# EAGLE design A100C (EAGLE 6.6.0)
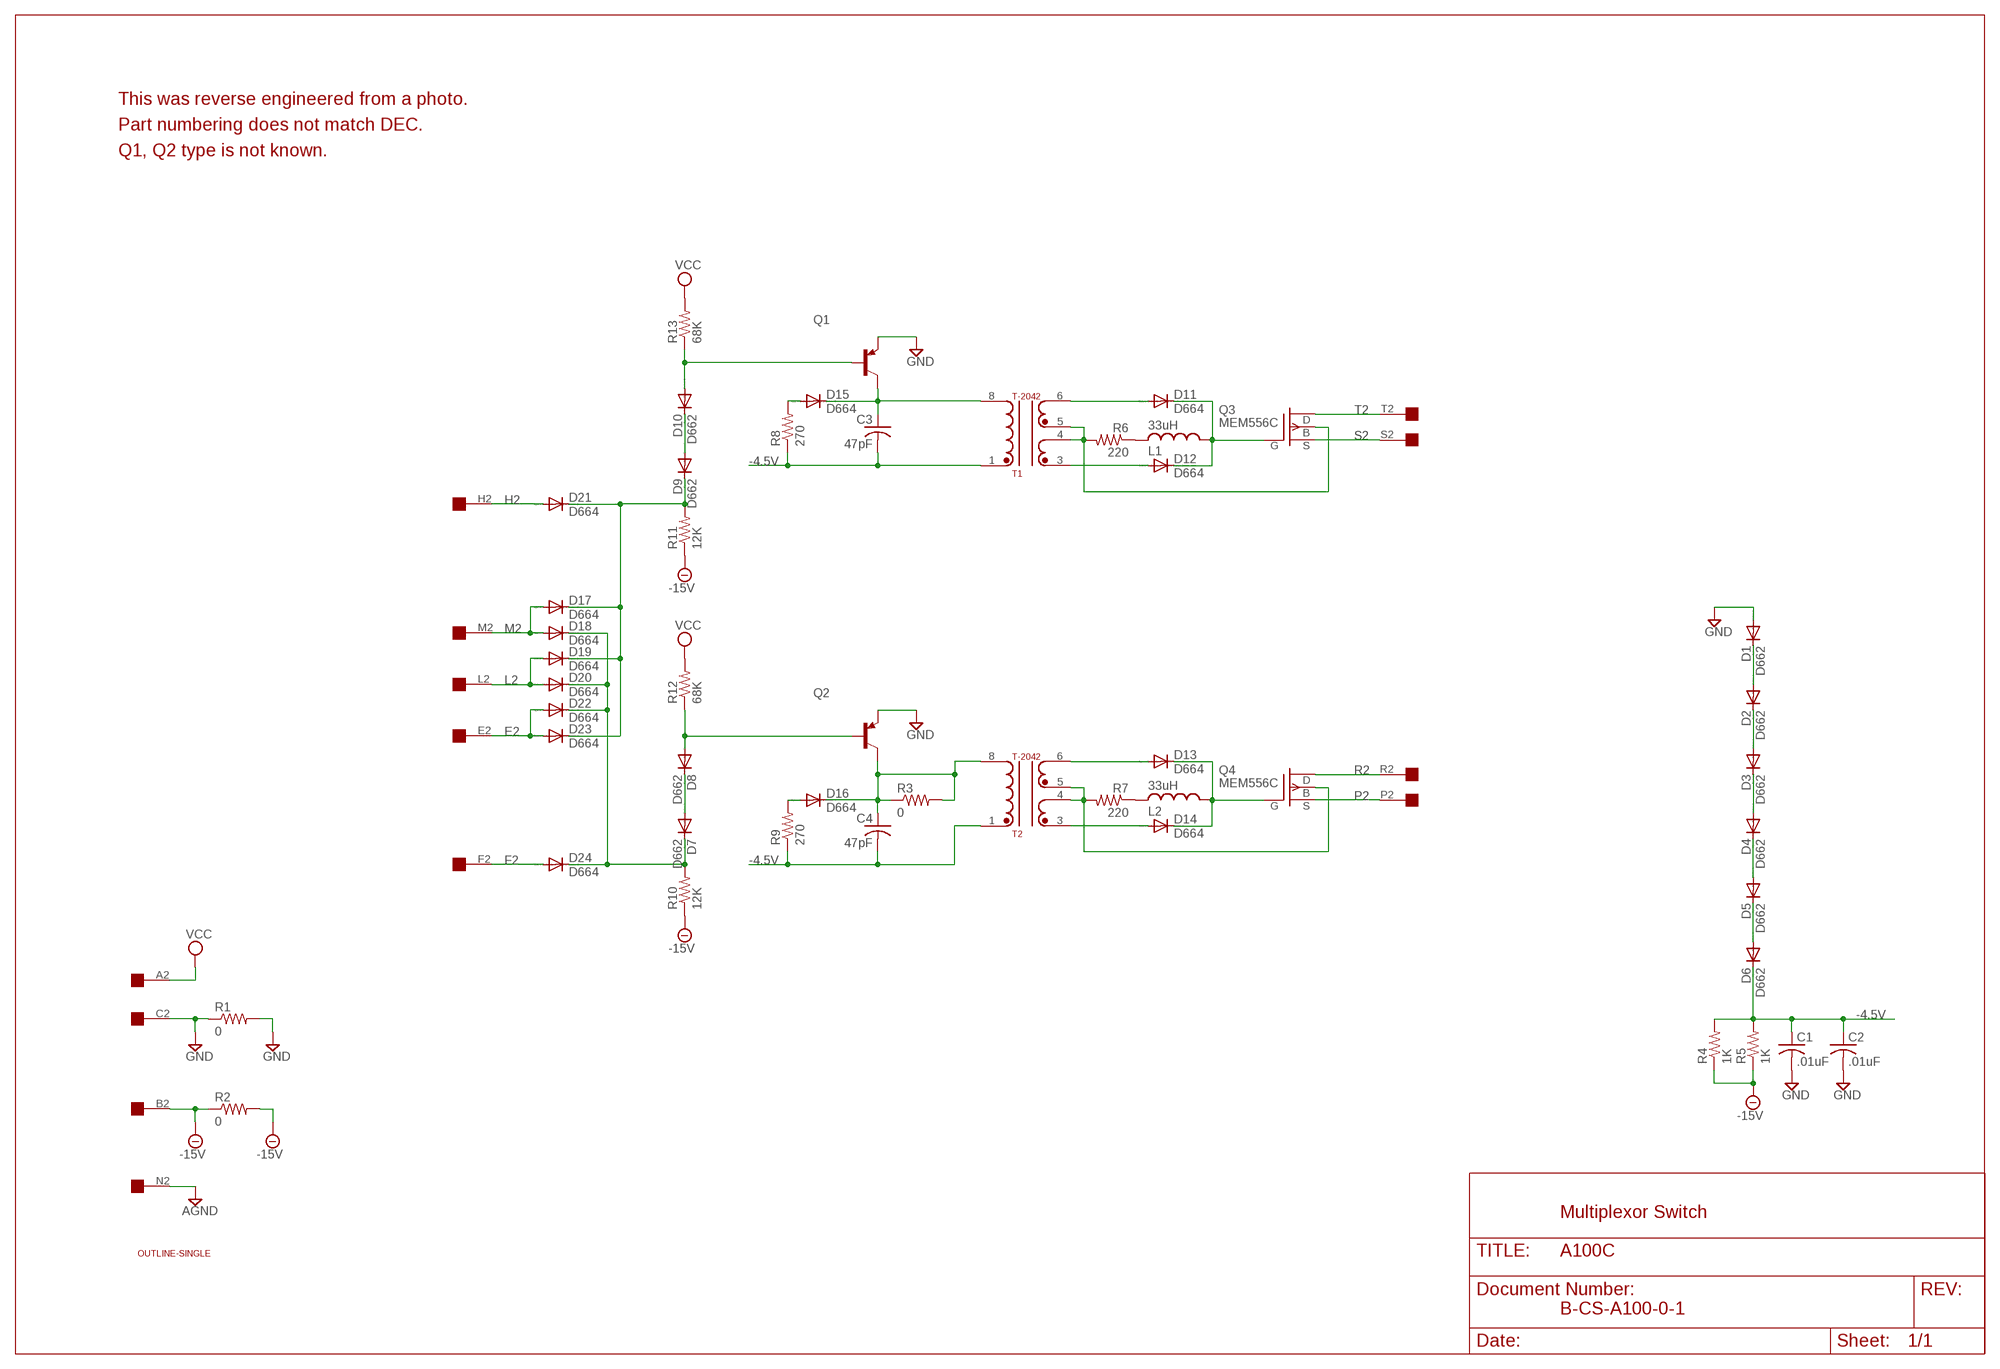
[diagram p0: schematic, sheet 1]

## Parts
C1  .01uF  C-US  [C063-025X075]
C2  .01uF  C-US  [C063-025X075]
C3  47pF  C-US  [C063-025X075]
C4  47pF  C-US  [C063-025X075]
D1  D662  DIODE-DO35-10  [DO35-10]
D2  D662  DIODE-DO35-10  [DO35-10]
D3  D662  DIODE-DO35-10  [DO35-10]
D4  D662  DIODE-DO35-10  [DO35-10]
D5  D662  DIODE-DO35-10  [DO35-10]
D6  D662  DIODE-DO35-10  [DO35-10]
D7  D662  DIODE-DO35-10  [DO35-10]
D8  D662  DIODE-DO35-10  [DO35-10]
D9  D662  DIODE-DO35-10  [DO35-10]
D10  D662  DIODE-DO35-10  [DO35-10]
D11  D664  DIODE-DO35-10  [DO35-10]
D12  D664  DIODE-DO35-10  [DO35-10]
D13  D664  DIODE-DO35-10  [DO35-10]
D14  D664  DIODE-DO35-10  [DO35-10]
D15  D664  DIODE-DO35-10  [DO35-10]
D16  D664  DIODE-DO35-10  [DO35-10]
D17  D664  DIODE-DO35-10  [DO35-10]
D18  D664  DIODE-DO35-10  [DO35-10]
D19  D664  DIODE-DO35-10  [DO35-10]
D20  D664  DIODE-DO35-10  [DO35-10]
D21  D664  DIODE-DO35-10  [DO35-10]
D22  D664  DIODE-DO35-10  [DO35-10]
D23  D664  DIODE-DO35-10  [DO35-10]
D24  D664  DIODE-DO35-10  [DO35-10]
L1  33uH  L-US0207/15  [0207/15]
L2  33uH  L-US0207/15  [0207/15]
Q1  -PNP-TO5  [TO5]
Q2  -PNP-TO5  [TO5]
Q3  MEM556C  [TO72]
Q4  MEM556C  [TO72]
R1  0  R-US_0207/10  [0207/10]
R2  0  R-US_0207/10  [0207/10]
R3  0  R-US_0207/10  [0207/10]
R4  1K  R-US_0207/10  [0207/10]
R5  1K  R-US_0207/10  [0207/10]
R6  220  R-US_0207/10  [0207/10]
R7  220  R-US_0207/10  [0207/10]
R8  270  R-US_0207/10  [0207/10]
R9  270  R-US_0207/10  [0207/10]
R10  12K  R-US_0207/10  [0207/10]
R11  12K  R-US_0207/10  [0207/10]
R12  68K  R-US_0207/10  [0207/10]
R13  68K  R-US_0207/10  [0207/10]
T1  T-2042  [TRANSFORMER6C]
T2  T-2042  [TRANSFORMER6C]
U$1  OUTLINE-SINGLE  [SINGLE]
U$2  EDGE-1  [EDGE-CON1]

## Nets
-4.5V: C1.1 C2.1 C3.2 C4.2 D6.C R4.2 R5.2 R8.1 R9.1 T1.1 T2.1
-15V: R2.1 R2.2 R4.1 R5.1 R10.1 R11.1 U$2.B2
AGND: U$2.N2
E2: D22.A D23.A U$2.E2
F2: D24.A U$2.F2
GND: C1.2 C2.2 D1.A Q1.1(E) Q2.1(E) R1.1 R1.2 U$2.C2
H2: D21.A U$2.H2
L2: D19.A D20.A U$2.L2
M2: D17.A D18.A U$2.M2
N$1: D1.C D2.A
N$2: D2.C D3.A
N$3: D3.C D4.A
N$4: D4.C D5.A
N$5: D5.C D6.A
N$6: C4.1 D16.C Q2.3(C) R3.1 R3.2 T2.8
N$7: D9.C D17.C D19.C D21.C D23.C R11.2
N$8: D7.C D18.C D20.C D22.C D24.C R10.2
N$9: D7.A D8.C
N$10: D9.A D10.C
N$11: D8.A Q2.2(B) R12.1
N$12: D10.A Q1.2(B) R13.1
N$13: C3.1 D15.C Q1.3(C) T1.8
N$14: D15.A R8.2
N$15: D16.A R9.2
N$16: Q3.4(B) R6.2 T1.4 T1.5
N$17: L1.2 R6.1
N$18: L2.2 R7.1
N$19: D11.C D12.C L1.1 Q3.1(G)
N$20: D13.C D14.C L2.1 Q4.1(G)
N$21: Q4.4(B) R7.2 T2.4 T2.5
N$22: D12.A T1.3
N$23: D11.A T1.6
N$24: D14.A T2.3
N$25: D13.A T2.6
P2: Q4.3(S) U$2.P2
R2: Q4.2(D) U$2.R2
S2: Q3.3(S) U$2.S2
T2: Q3.2(D) U$2.T2
VCC: R12.2 R13.2 U$2.A2
Unconnected: U$2.D2 U$2.J2 U$2.K2 U$2.U2 U$2.V2

## Notes on the sheet
- This was reverse engineered from a photo.
- Part numbering does not match DEC.
- Q1, Q2 type is not known.
- Multiplexor Switch
- B-CS-A100-0-1

## Library data of the parts
C1-C4 = dec-con:C-US: Capacitors with funky DEC lead spacing.
D1-D24 = diode:DIODE-: DIODE
L1 L2 = rcl:L-US: INDUCTOR, American symbol
Q1 Q2 = transistor:*-PNP-: PNP Transistror
Q3 Q4 = dec-con:MEM556C: Analog Switching FET
R1-R13 = rcl:R-US_: RESISTOR, American symbol
T1 T2 = dec-con:T-2042: T-2042 Transformer
U$1 = dec-con:OUTLINE-*: Board outlines for DEC boards.
U$2 = dec-con:EDGE-1: Single-Sided DEC Edge Connector -- (side 2)

## Net classes
0 default: width 0.813 mm

## Board
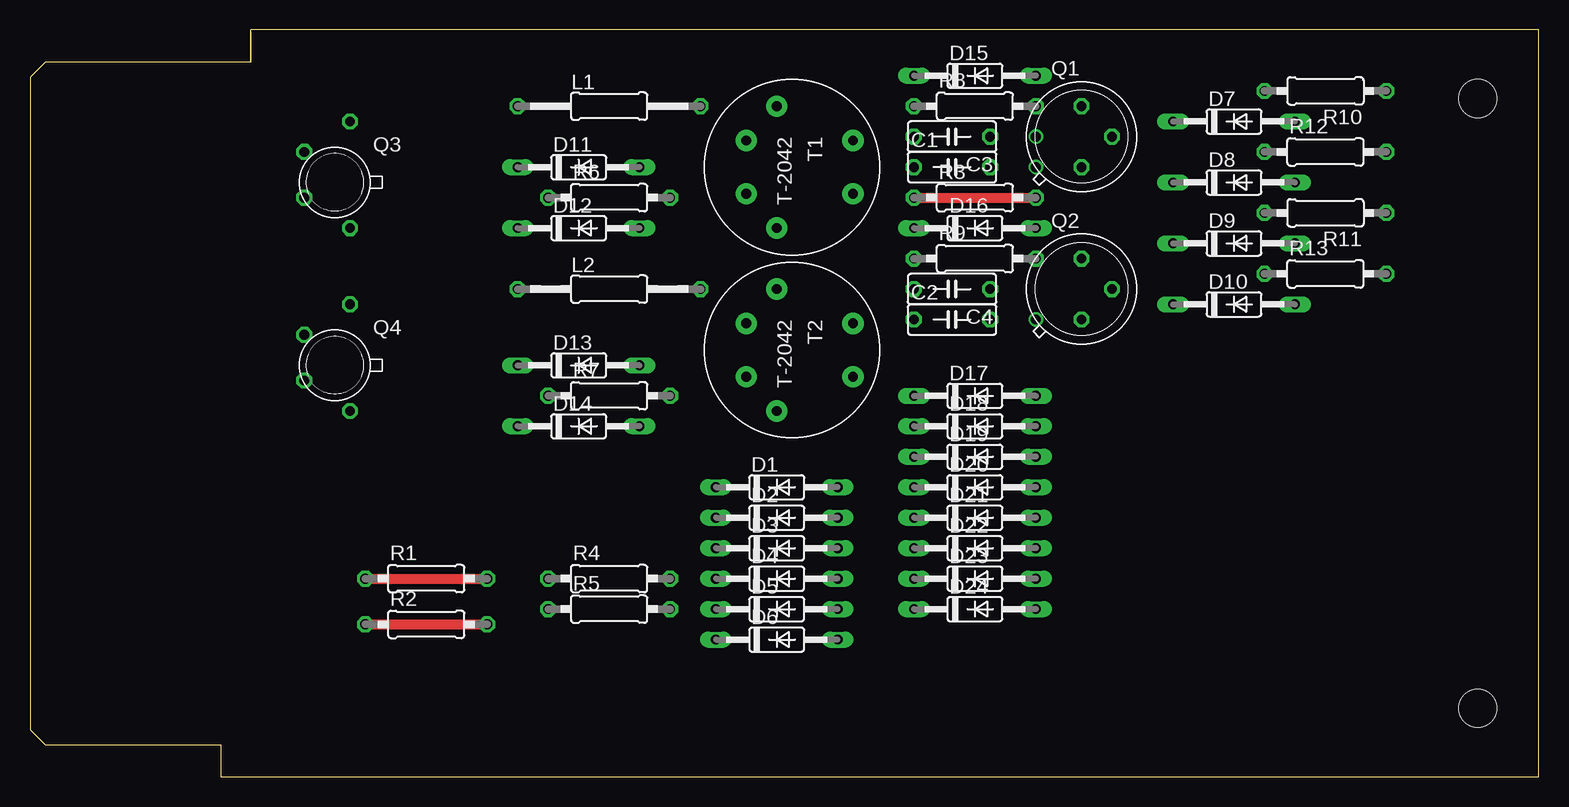
[diagram p1: board, top side]
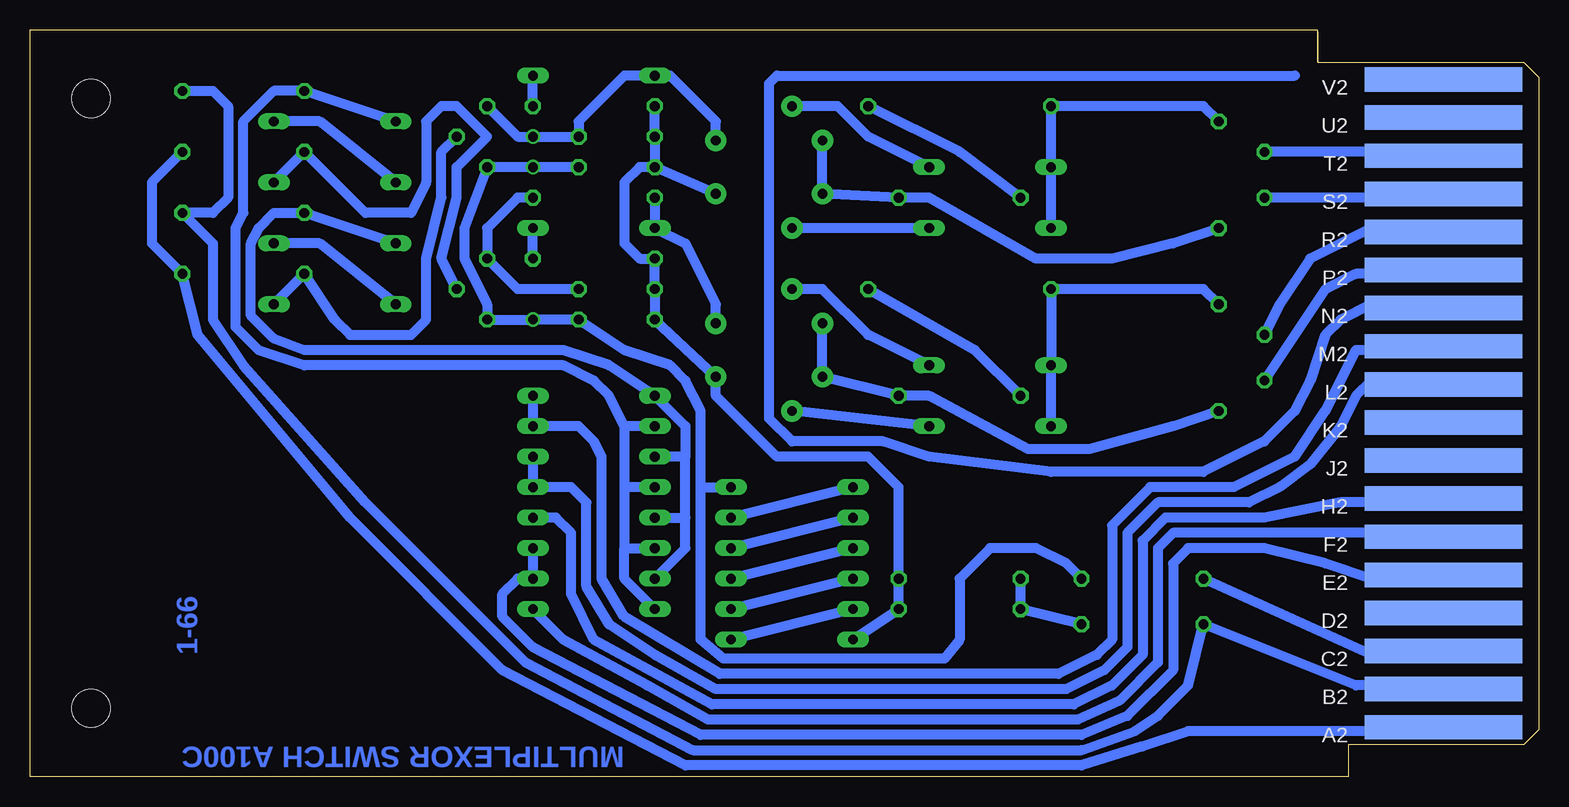
[diagram p2: board, bottom side, seen from below]

Size 125.73 x 62.23 mm. Coordinates in mm from the lower left corner, seen from the top.
Copper layers (1+16): Top 0.035mm / dielectric 1.5mm / Bottom 0.035mm
Design rules "16mils": minimum track width 16mil, minimum drill 32mil, track to track 15mil, track to pad 10mil, pad to pad 10mil, via to via 10mil, smd to smd 10mil, copper to edge 13mil, drill to drill 10mil, minimum pad ring 10mil, minimum via ring 8mil, stop-mask expansion 0mil, vias tented up to drill 0mil, thermal gap 10mil

### Footprints (pad centres in the part's own frame; a part is rotated, then mirrored left to right if it is on the bottom)
C063-025X075 = drill 0.813 octagon: 1 -2.54,0; 2 3.81,0
DO35-10 = drill 0.813 long: A 5.08,0; C -5.08,0
0207/15 = drill 0.813 octagon: 1 -7.62,0; 2 7.62,0
TO5 = drill 0.813 octagon: 1 0,-2.54; 2 2.54,0; 3 0,2.54
TO72 = drill 0.813 octagon: 1 -1.27,-5.08; 2 2.54,-2.54; 3 2.54,1.27; 4 -1.27,3.81
0207/10 = drill 0.813 octagon: 1 -5.08,0; 2 5.08,0
TRANSFORMER6C = drill 0.813 pad 1.778: 1 2.223,5.08; 3 5.08,-1.27; 4 2.223,-3.81; 5 -2.223,-3.81; 6 -5.08,-1.27; 8 -2.223,5.08
SINGLE = hole 3.175: 120.65,56.515; 120.65,5.715
EDGE-CON1 = smd 13.106 x 2.032 bottom: A2 7.938,4.128; B2 7.938,7.303; C2 7.938,10.477; D2 7.938,13.652; E2 7.938,16.828; F2 7.938,20.003; H2 7.938,23.177; J2 7.938,26.352; K2 7.938,29.527; L2 7.938,32.703; M2 7.938,35.877; N2 7.938,39.053; P2 7.938,42.227; R2 7.938,45.403; S2 7.938,48.578; T2 7.938,51.752; U2 7.938,54.928; V2 7.938,58.102

### Placement (x,y rotation side)
C1  76.2,50.8 0 top
C2  76.2,38.1 0 top
C3  77.47,53.34 180 top
C4  77.47,40.64 180 top
D1  62.23,24.13 0 top
D2  62.23,21.59 0 top
D3  62.23,19.05 0 top
D4  62.23,16.51 0 top
D5  62.23,13.97 0 top
D6  62.23,11.43 0 top
D7  100.33,54.61 0 top
D8  100.33,49.53 0 top
D9  100.33,44.45 0 top
D10  100.33,39.37 0 top
D11  45.72,50.8 0 top
D12  45.72,45.72 0 top
D13  45.72,34.29 0 top
D14  45.72,29.21 0 top
D15  78.74,58.42 0 top
D16  78.74,45.72 0 top
D17  78.74,31.75 0 top
D18  78.74,29.21 0 top
D19  78.74,26.67 0 top
D20  78.74,24.13 0 top
D21  78.74,21.59 0 top
D22  78.74,19.05 0 top
D23  78.74,16.51 0 top
D24  78.74,13.97 0 top
L1  48.26,55.88 0 top
L2  48.26,40.64 0 top
Q1  87.63,53.34 0 top
Q2  87.63,40.64 0 top
Q3  25.4,49.53 180 top
Q4  25.4,34.29 180 top
R1  33.02,16.51 0 top
R2  33.02,12.7 0 top
R3  78.74,48.26 0 top
R4  48.26,16.51 0 top
R5  48.26,13.97 0 top
R6  48.26,48.26 0 top
R7  48.26,31.75 0 top
R8  78.74,55.88 0 top
R9  78.74,43.18 0 top
R10  107.95,57.15 180 top
R11  107.95,46.99 180 top
R12  107.95,52.07 0 top
R13  107.95,41.91 0 top
T1  63.5,50.8 270 top
T2  63.5,35.56 270 top
U$1  0,0 0 top
U$2  0,0 0 top

### Tracks (layer width: path | path; a pad name or v marks a point on that pad's centre or on a via)
-4.5V
  Bottom 0.813: D6.C R5.2 R4.2 53.34,24.13 55.88,26.67 63.5,26.67 68.58,31.75 T2.1 C2.1 C4.2 R9.1 74.93,43.18 76.2,44.45 76.2,49.53 74.93,50.8 C1.1 | R8.1 C3.2 C1.1 | T1.1 C1.1
-15V
  Top 0.813: R2.1 R2.2
  Bottom 0.813: U$2.B2 8.89,7.62 15.24,7.62 R2.1 29.21,7.62 31.75,5.08 33.66,3.81 38.1,2.22 70.49,2.22 84.46,9.53 97.79,22.86 107.95,34.29 110.49,38.1 110.49,44.45 R11.1 110.49,46.99 109.22,48.26 109.22,55.88 110.49,57.15 R10.1 | R2.2 R5.1 R4.1
AGND
  Bottom 0.813: U$2.N2 8.89,39.37 13.97,39.37 16.51,38.1 17.78,36.83 19.05,33.02 20.32,30.48 22.86,27.94 27.94,25.4 40.64,25.4 50.8,26.67 54.61,27.94 62.23,27.94 64.14,29.84 64.14,57.78 63.5,58.42 20.32,58.42
E2
  Bottom 0.813: U$2.E2 8.89,16.51 13.97,16.51 17.78,17.78 22.86,19.05 29.21,19.05 30.48,17.78 30.48,8.89 34.29,5.08 38.1,3.49 69.85,3.49 83.82,10.79 86.36,13.34 86.36,15.24 85.09,16.51 D23.A D22.A
F2
  Bottom 0.813: U$2.F2 8.89,20.32 30.48,20.32 31.75,19.05 31.75,9.53 34.93,6.35 38.42,4.76 69.22,4.76 74.3,7.62 81.28,11.43 D24.A
GND  (via drill 0.81)
  Top 0.813: R1.1 R1.2
  Bottom 0.813: U$2.C2 8.89,10.48 8.89,10.16 13.97,10.16 R1.1 | R1.2 39.37,17.78 41.91,19.05 45.72,19.05 48.26,16.51 48.26,11.43 49.53,9.84 67.95,9.84 69.85,11.43 69.85,24.13 | 69.85,24.13 D1.A | 69.85,24.13 69.85,30.48 71.12,33.02 72.39,34.29 76.2,35.56 C2.2 v83.82,38.1 Q2.1 87.63,39.37 89.54,43.18 89.54,45.72 Q1.1 v83.82,50.8 C1.2
H2
  Bottom 0.813: U$2.H2 8.89,22.86 16.51,22.86 22.86,21.59 31.12,21.59 33.02,19.68 33.02,10.16 35.56,7.62 38.74,6.03 68.9,6.03 78.74,11.43 80.65,15.24 80.65,20.32 81.92,21.59 D21.A
L2
  Bottom 0.813: U$2.L2 8.89,33.02 13.97,33.02 15.24,31.75 16.51,29.21 19.05,26.04 21.59,24.13 24.13,22.86 31.75,22.86 34.29,20.32 34.29,10.79 36.2,8.89 39.37,7.3 68.58,7.3 73.66,10.16 77.47,12.7 79.38,15.88 79.38,22.86 80.65,24.13 D20.A D19.A
M2
  Bottom 0.813: U$2.M2 8.89,35.56 15.24,35.56 17.78,30.48 20.32,26.67 25.4,24.13 32.39,24.13 35.56,20.95 35.56,11.43 36.83,10.16 40.01,8.57 68.26,8.57 76.2,13.34 78.11,16.51 78.11,26.67 78.74,27.94 80.01,29.21 D18.A D17.A
N$1
  Bottom 0.813: D1.C D2.A
N$2
  Bottom 0.813: D2.C D3.A
N$3
  Bottom 0.813: D3.C D4.A
N$4
  Bottom 0.813: D4.C D5.A
N$5
  Bottom 0.813: D5.C D6.A
N$6
  Top 0.813: R3.1 R3.2
  Bottom 0.813: R3.1 D16.C 71.12,44.45 68.58,39.37 T2.8 | C4.1 85.09,40.64 Q2.3 87.63,45.72 85.09,48.26 R3.2
N$7
  Bottom 0.813: D9.C R11.2 105.41,46.99 106.68,45.72 107.32,44.45 107.32,38.42 105.41,36.51 102.87,35.56 81.28,35.56 77.47,34.29 D17.C 71.12,29.21 71.12,26.67 | 71.12,26.67 D19.C | D23.C 71.12,19.05 71.12,21.59 | D21.C 71.12,21.59 | 71.12,21.59 71.12,26.67
N$8
  Bottom 0.813: D7.C R10.2 105.41,57.15 107.95,54.61 107.95,46.99 108.59,45.72 108.59,37.47 106.68,35.56 102.87,34.29 81.28,34.29 78.74,33.02 77.47,31.75 76.2,29.21 | D24.C 76.2,16.51 76.2,19.05 | 76.2,19.05 D22.C | D20.C 76.2,24.13 | 76.2,24.13 76.2,19.05 | D18.C 76.2,29.21 | 76.2,29.21 76.2,24.13
N$9
  Bottom 0.813: D8.C 101.6,54.61 D7.A
N$10
  Bottom 0.813: D10.C 101.6,44.45 D9.A
N$11
  Bottom 0.813: D8.A R12.1 97.79,46.99 93.98,46.99 92.71,49.53 92.71,54.61 91.44,55.88 90.17,55.88 87.63,53.34 90.17,50.8 90.17,48.26 91.44,43.18 Q2.2
N$12
  Bottom 0.813: D10.A R13.1 100.33,38.1 99.06,36.83 93.98,36.83 92.71,38.1 92.71,43.18 91.44,48.26 91.44,52.07 Q1.2
N$13  (via drill 0.81)
  Bottom 0.813: Q1.3 85.09,53.34 v83.82,53.34 C3.1 80.01,54.61 76.2,58.42 D15.C 72.39,58.42 68.58,54.61 T1.8
N$14
  Bottom 0.813: R8.2 D15.A
N$15
  Bottom 0.813: R9.2 D16.A
N$16
  Bottom 0.813: T1.5 T1.4 R6.2 50.8,48.26 41.91,43.18 35.56,43.18 30.48,44.45 Q3.4
N$17
  Bottom 0.813: R6.1 48.26,52.07 L1.2
N$18
  Bottom 0.813: R7.1 46.99,35.56 L2.2
N$19
  Bottom 0.813: D12.C D11.C L1.1 27.94,55.88 Q3.1
N$20
  Bottom 0.813: D14.C D13.C L2.1 27.94,40.64 Q4.1
N$21
  Bottom 0.813: T2.5 T2.4 R7.2 50.8,31.75 42.55,27.3 37.47,27.3 30.48,29.21 Q4.4
N$22
  Bottom 0.813: D12.A T1.3
N$23
  Bottom 0.813: D11.A 55.88,53.34 58.42,55.88 T1.6
N$24
  Bottom 0.813: D14.A T2.3
N$25
  Bottom 0.813: D13.A 55.88,36.83 59.69,40.64 T2.6
P2
  Bottom 0.813: U$2.P2 8.89,41.91 15.24,41.91 17.78,40.64 Q4.3
R2
  Bottom 0.813: U$2.R2 8.89,45.72 13.97,45.72 19.05,43.18 21.59,39.37 Q4.2
S2
  Bottom 0.813: U$2.S2 7.62,48.26 Q3.3
T2
  Bottom 0.813: U$2.T2 8.89,52.07 Q3.2
VCC
  Bottom 0.813: U$2.A2 8.89,3.81 29.21,3.81 33.02,2.54 38.1,0.95 71.12,0.95 86.36,8.89 99.06,21.59 111.76,36.83 R13.2 115.57,44.45 115.57,49.53 R12.2

### Text on the board
Bottom: 1-66 | MULTIPLEXOR SWITCH | A100C